# Altium project SPEC_A7.PrjPcb (part 6 of 7)

## Sheet Power.SchDoc: SPEC-A7
size 420 x 297 mm; Author: G.Kasprowicz; CompanyName: WUT ISE; DrawnBy: G.Kasprowicz; Organization: WUT ISE; Address1: PW ISE; Address2: Nowowiejska 15/19 00-665 Warsaw; Address3: gkasprow@gmail.com; Revision: 2; SheetNumber: 2; SheetTotal: 18; ModifiedBy: -; CheckedDate: -; Title2: Power supply; DivGrp: WUT ISE; Designer: G.Kasprowicz; ModifiedDate: -; ProjectName: Sensor Box
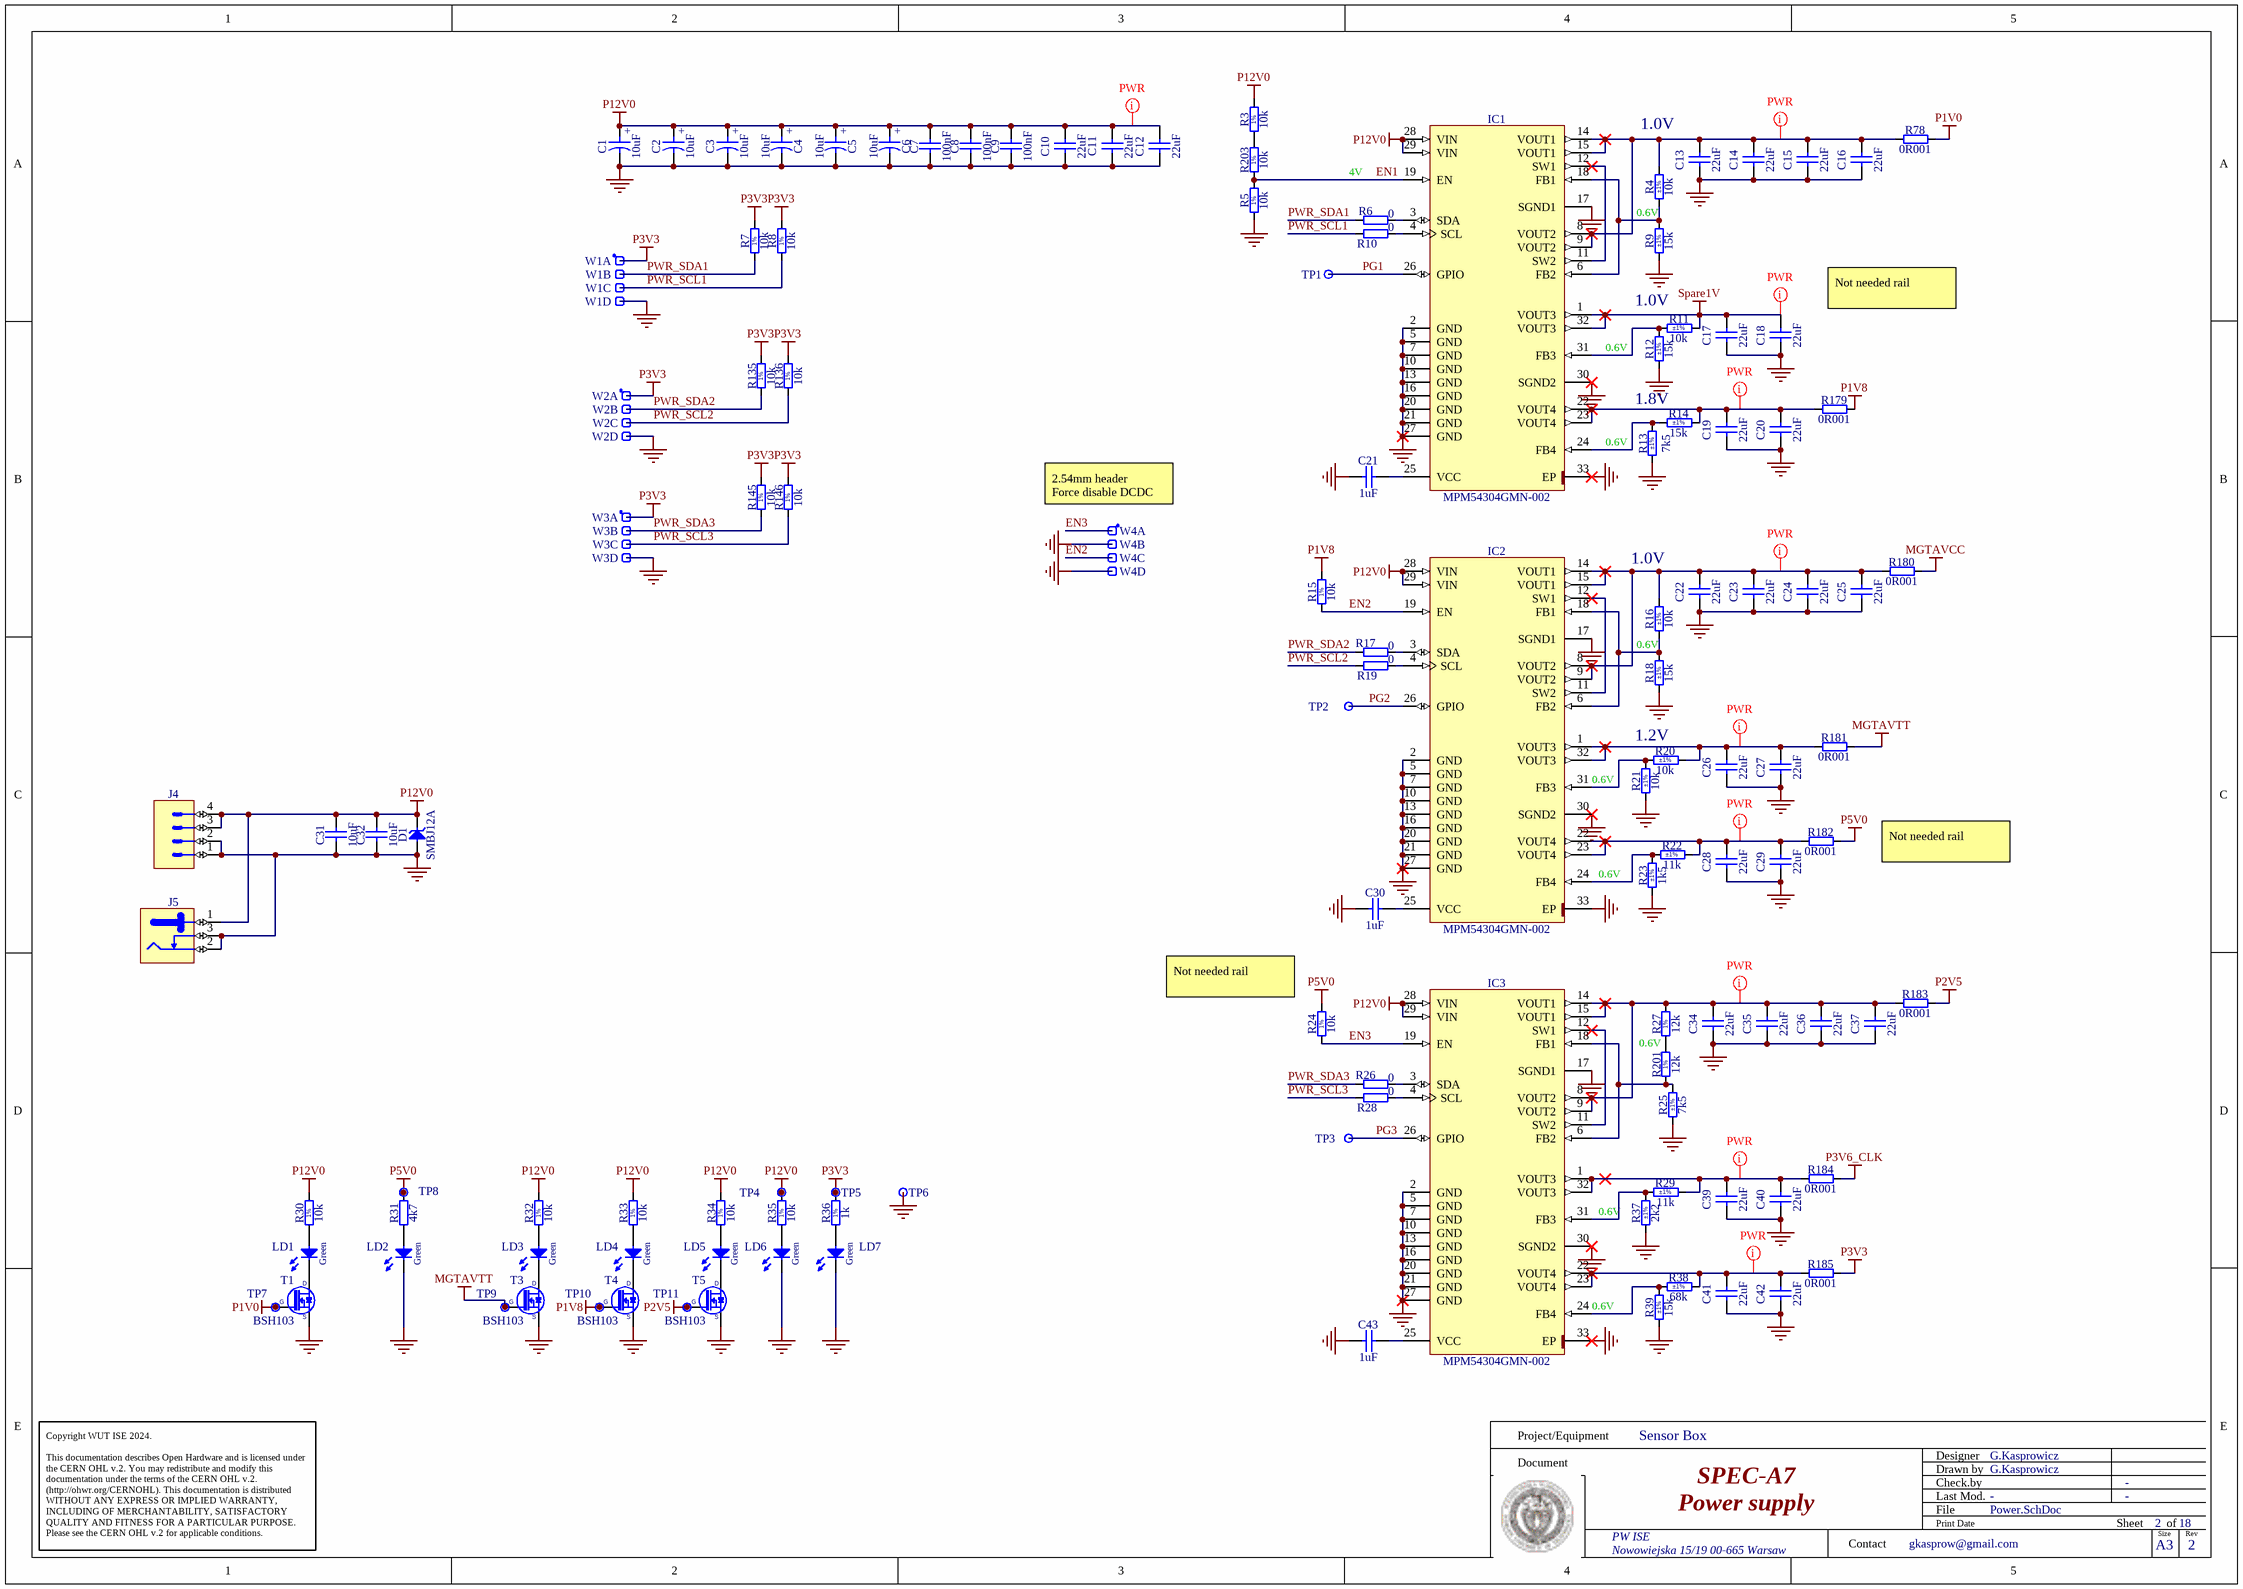
[diagram p14: Power.SchDoc]

### Parts
C1  10uF  [CAPMP3216X180N]
C2  10uF  [CAPMP3216X180N]
C3  10uF  [CAPMP3216X180N]
C4  10uF  [CAPMP3216X180N]
C5  10uF  [CAPMP3216X180N]
C6  10uF  [CAPMP3216X180N]
C7  100nF  [CAPC1005X55N]
C8  100nF  [CAPC1005X55N]
C9  100nF  [CAPC1005X55N]
C10  22uF  [CAPC2012X135N]
C11  22uF  [CAPC2012X135N]
C12  22uF  [CAPC2012X135N]
C13  22uF  [CAPC2012X135N]
C14  22uF  [CAPC2012X135N]
C15  22uF  [CAPC2012X135N]
C16  22uF  [CAPC2012X135N]
C17  22uF  [CAPC2012X135N]
C18  22uF  [CAPC2012X135N]
C19  22uF  [CAPC2012X135N]
C20  22uF  [CAPC2012X135N]
C21  1uF  [CAPC1005X55N]
C22  22uF  [CAPC2012X135N]
C23  22uF  [CAPC2012X135N]
C24  22uF  [CAPC2012X135N]
C25  22uF  [CAPC2012X135N]
C26  22uF  [CAPC2012X135N]
C27  22uF  [CAPC2012X135N]
C28  22uF  [CAPC2012X135N]
C29  22uF  [CAPC2012X135N]
C30  1uF  [CAPC1005X55N]
C31  10uF  [CAPC1608X80N]
C32  10uF  [CAPC1608X80N]
C34  22uF  [CAPC2012X135N]
C35  22uF  [CAPC2012X135N]
C36  22uF  [CAPC2012X135N]
C37  22uF  [CAPC2012X135N]
C39  22uF  [CAPC2012X135N]
C40  22uF  [CAPC2012X135N]
C41  22uF  [CAPC2012X135N]
C42  22uF  [CAPC2012X135N]
C43  1uF  [CAPC1005X55N]
D1  SMBJ12A  [DIOM5336X265N]
IC1  MPM54304GMN-002  [MPS_MPM54304GMN]
IC2  MPM54304GMN-002  [MPS_MPM54304GMN]
IC3  MPM54304GMN-002  [MPS_MPM54304GMN]
J4  Mini-Fit Jr.™  [MOLEX_39-30-0040]  (value not drawn)
J5  Jack  [CUI_PJ-102BH]  (value not drawn)
LD1  Green  [LED_KINGBRIGHT_KPH-1608CGCK]
LD2  Green  [LED_KINGBRIGHT_KPH-1608CGCK]
LD3  Green  [LED_KINGBRIGHT_KPH-1608CGCK]
LD4  Green  [LED_KINGBRIGHT_KPH-1608CGCK]
LD5  Green  [LED_KINGBRIGHT_KPH-1608CGCK]
LD6  Green  [LED_KINGBRIGHT_KPH-1608CGCK]
LD7  Green  [LED_KINGBRIGHT_KPH-1608CGCK]
R3  10k  [RESC1005X40N]
R4  10k  Tolerance: ±1%  [RESC1005X40N]
R5  10k  [RESC1005X40N]
R6  0  [RESC1005X40N]
R7  10k  [RESC1005X40N]
R8  10k  [RESC1005X40N]
R9  15k  Tolerance: ±1%  [RESC1005X40N]
R10  0  [RESC1005X40N]
R11  10k  Tolerance: ±1%  [RESC1005X40N]
R12  15k  Tolerance: ±1%  [RESC1005X40N]
R13  7k5  Tolerance: ±1%  [RESC1005X40N]
R14  15k  Tolerance: ±1%  [RESC1005X40N]
R15  10k  [RESC1005X40N]
R16  10k  Tolerance: ±1%  [RESC1005X40N]
R17  0  [RESC1005X40N]
R18  15k  Tolerance: ±1%  [RESC1005X40N]
R19  0  [RESC1005X40N]
R20  10k  Tolerance: ±1%  [RESC1005X40N]
R21  10k  Tolerance: ±1%  [RESC1005X40N]
R22  11k  Tolerance: ±1%  [RESC1005X40N]
R23  1k5  Tolerance: ±1%  [RESC1005X40N]
R24  10k  [RESC1005X40N]
R25  7k5  Tolerance: ±1%  [RESC1005X40N]
R26  0  [RESC1005X40N]
R27  12k  [RESC1005X40N]
R28  0  [RESC1005X40N]
R29  11k  Tolerance: ±1%  [RESC1005X40N]
R30  10k  [RESC1005X40N]
R31  4k7  [RESC1005X40N]
R32  10k  [RESC1005X40N]
R33  10k  [RESC1005X40N]
R34  10k  [RESC1005X40N]
R35  10k  [RESC1005X40N]
R36  1k  [RESC1005X40N]
R37  2k2  Tolerance: ±1%  [RESC1005X40N]
R38  68k  Tolerance: ±1%  [RESC1005X40N]
R39  15k  Tolerance: ±1%  [RESC1005X40N]
R78  0R001  [RESC2012X60N]
R135  10k  [RESC1005X40N]
R136  10k  [RESC1005X40N]
R145  10k  [RESC1005X40N]
R146  10k  [RESC1005X40N]
R179  0R001  [RESC2012X60N]
R180  0R001  [RESC2012X60N]
R181  0R001  [RESC2012X60N]
R182  0R001  [RESC2012X60N]
R183  0R001  [RESC2012X60N]
R184  0R001  [RESC2012X60N]
R185  0R001  [RESC2012X60N]
R201  12k  [RESC1005X40N]
R203  10k  [RESC1005X40N]
T1  BSH103  [SOT95P230X110-3N]
T3  BSH103  [SOT95P230X110-3N]
T4  BSH103  [SOT95P230X110-3N]
T5  BSH103  [SOT95P230X110-3N]
TP1  Test Point  [TPS127]  (value not drawn)  (no BOM)
TP2  Test Point  [TPS127]  (value not drawn)  (no BOM)
TP3  Test Point  [TPS127]  (value not drawn)  (no BOM)
TP4  Test Point  [TPS127]  (value not drawn)  (no BOM)
TP5  Test Point  [TPS127]  (value not drawn)  (no BOM)
TP6  Test Point  [TPS127]  (value not drawn)  (no BOM)
TP7  Test Point  [TPS127]  (value not drawn)  (no BOM)
TP8  Test Point  [TPS127]  (value not drawn)  (no BOM)
TP9  Test Point  [TPS127]  (value not drawn)  (no BOM)
TP10  Test Point  [TPS127]  (value not drawn)  (no BOM)
TP11  Test Point  [TPS127]  (value not drawn)  (no BOM)
W1  Header 4  [SAMTEC_HTSW-104-23-L-S]  (value not drawn)  (parts A,B,C,D of 4)
W2  Header 4  [SAMTEC_HTSW-104-23-L-S]  (value not drawn)  (parts A,B,C,D of 4)
W3  Header 4  [SAMTEC_HTSW-104-23-L-S]  (value not drawn)  (parts A,B,C,D of 4)
W4  Header 4  [SAMTEC_HTSW-104-23-L-S]  (value not drawn)  (parts A,B,C,D of 4)

### Nets
GND: C1.2 C2.2 C3.2 C4.2 C5.2 C6.2 C7.1 C8.1 C9.1 C10.1 C11.1 C12.1 C13.1 C14.1 C15.1 C16.1 C17.1 C18.1 C19.1 C20.1 C21.1 C22.1 C23.1 C24.1 C25.1 C26.1 C27.1 C28.1 C29.1 C30.1 C31.1 C32.1 C34.1 C35.1 C36.1 C37.1 C39.1 C40.1 C41.1 C42.1 C43.1 D1.2(A) IC1.2(GND) IC1.5(GND) IC1.7(GND) IC1.10(GND) IC1.13(GND) IC1.16(GND) IC1.17(SGND1) IC1.20(GND) IC1.21(GND) IC1.27(GND) IC1.30(SGND2) IC1.33(EP) IC2.2(GND) IC2.5(GND) IC2.7(GND) IC2.10(GND) IC2.13(GND) IC2.16(GND) IC2.17(SGND1) IC2.20(GND) IC2.21(GND) IC2.27(GND) IC2.30(SGND2) IC2.33(EP) IC3.2(GND) IC3.5(GND) IC3.7(GND) IC3.10(GND) IC3.13(GND) IC3.16(GND) IC3.17(SGND1) IC3.20(GND) IC3.21(GND) IC3.27(GND) IC3.30(SGND2) IC3.33(EP) J4.1 J4.2 J5.2 J5.3 LD2.1(C) LD6.1(C) LD7.1(C) R5.1 R9.1 R12.1 R13.1 R18.1 R21.1 R23.1 R25.1 R37.1 R39.1 T1.2(S) T3.2(S) T4.2(S) T5.2(S) TP6.1 W1.4 W2.4 W3.4 W4.2 W4.4
MGTAVCC: R180.2
MGTAVTT: R181.2 T3.1(G) TP9.1
P1V0: R78.2 T1.1(G) TP7.1
P1V8: R15.2 R179.2 T4.1(G) TP10.1
P2V5: R183.2 T5.1(G) TP11.1
P3V3: R7.2 R8.2 R36.2 R135.2 R136.2 R145.2 R146.2 R185.2 TP5.1 W1.1 W2.1 W3.1
P3V6_CLK: R184.2
P5V0: R24.2 R31.2 R182.2 TP8.1
P12V0: C1.1 C2.1 C3.1 C4.1 C5.1 C6.1 C7.2 C8.2 C9.2 C10.2 C11.2 C12.2 C31.2 C32.2 D1.1(C) IC1.28(VIN) IC1.29(VIN) IC2.28(VIN) IC2.29(VIN) IC3.28(VIN) IC3.29(VIN) J4.3 J4.4 J5.1 R3.2 R30.2 R32.2 R33.2 R34.2 R35.2 TP4.1
Spare1V: C17.2 C18.2 IC1.1(VOUT3) IC1.32(VOUT3) R11.2
EN1: IC1.19(EN) R5.2 R203.1
EN2: IC2.19(EN) R15.1 W4.3
EN3: IC3.19(EN) R24.1 W4.1
PG1: IC1.26(GPIO) TP1.1
PG2: IC2.26(GPIO) TP2.1
PG3: IC3.26(GPIO) TP3.1
PWR_SCL1: R8.1 R10.1 W1.3
PWR_SCL2: R19.1 R136.1 W2.3
PWR_SCL3: R28.1 R146.1 W3.3
PWR_SDA1: R6.1 R7.1 W1.2
PWR_SDA2: R17.1 R135.1 W2.2
PWR_SDA3: R26.1 R145.1 W3.2
NetC13_2: C13.2 C14.2 C15.2 C16.2 IC1.8(VOUT2) IC1.9(VOUT2) IC1.14(VOUT1) IC1.15(VOUT1) R4.2 R78.1
NetC19_2: C19.2 C20.2 IC1.22(VOUT4) IC1.23(VOUT4) R14.2 R179.1
NetC21_2: C21.2 IC1.25(VCC)
NetC22_2: C22.2 C23.2 C24.2 C25.2 IC2.8(VOUT2) IC2.9(VOUT2) IC2.14(VOUT1) IC2.15(VOUT1) R16.2 R180.1
NetC26_2: C26.2 C27.2 IC2.1(VOUT3) IC2.32(VOUT3) R20.2 R181.1
NetC28_2: C28.2 C29.2 IC2.22(VOUT4) IC2.23(VOUT4) R22.2 R182.1
NetC30_2: C30.2 IC2.25(VCC)
NetC34_2: C34.2 C35.2 C36.2 C37.2 IC3.8(VOUT2) IC3.9(VOUT2) IC3.14(VOUT1) IC3.15(VOUT1) R27.2 R183.1
NetC39_2: C39.2 C40.2 IC3.1(VOUT3) IC3.32(VOUT3) R29.2 R184.1
NetC41_2: C41.2 C42.2 IC3.22(VOUT4) IC3.23(VOUT4) R38.2 R185.1
NetC43_2: C43.2 IC3.25(VCC)
NetIC1_3: IC1.3(SDA) R6.2
NetIC1_4: IC1.4(SCL) R10.2
NetIC1_6: IC1.6(FB2) IC1.18(FB1) R4.1 R9.2
NetIC1_11: IC1.11(SW2) IC1.12(SW1)
NetIC1_24: IC1.24(FB4) R13.2 R14.1
NetIC1_31: IC1.31(FB3) R11.1 R12.2
NetIC2_3: IC2.3(SDA) R17.2
NetIC2_4: IC2.4(SCL) R19.2
NetIC2_6: IC2.6(FB2) IC2.18(FB1) R16.1 R18.2
NetIC2_11: IC2.11(SW2) IC2.12(SW1)
NetIC2_24: IC2.24(FB4) R22.1 R23.2
NetIC2_31: IC2.31(FB3) R20.1 R21.2
NetIC3_3: IC3.3(SDA) R26.2
NetIC3_4: IC3.4(SCL) R28.2
NetIC3_6: IC3.6(FB2) IC3.18(FB1) R25.2 R201.1
NetIC3_11: IC3.11(SW2) IC3.12(SW1)
NetIC3_24: IC3.24(FB4) R38.1 R39.2
NetIC3_31: IC3.31(FB3) R29.1 R37.2
NetLD1_1: LD1.1(C) T1.3(D)
NetLD1_2: LD1.2(A) R30.1
NetLD2_2: LD2.2(A) R31.1
NetLD3_1: LD3.1(C) T3.3(D)
NetLD3_2: LD3.2(A) R32.1
NetLD4_1: LD4.1(C) T4.3(D)
NetLD4_2: LD4.2(A) R33.1
NetLD5_1: LD5.1(C) T5.3(D)
NetLD5_2: LD5.2(A) R34.1
NetLD6_2: LD6.2(A) R35.1
NetLD7_2: LD7.2(A) R36.1
NetR3_1: R3.1 R203.2
NetR27_1: R27.1 R201.2

### Layout directives
net class PWR: NetC13_2, NetC19_2, NetC22_2, NetC26_2, NetC28_2, NetC34_2, NetC39_2, NetC41_2, P12V0, Spare1V

### Notes on the sheet
- 4V
- 1.0V
- 0.6V
- (near C18) Not needed rail
- 1.8V
- (near W4) 2.54mm header
  Force disable DCDC
- 1.2V
- (near R182) Not needed rail
- (near R24) Not needed rail
- (near IC3) 0.6V
- Project/Equipment
- Document
- Designer
- Drawn by
- Check.by
- Copyright WUT ISE 2024.
  This documentation describes Open Hardware and is licensed under the CERN OHL v.2. You may redistribute and modify this documentation under the terms of the CERN OHL v.2. (http://ohwr.org/CERNOHL). This documentation is distributed WITHOUT ANY EXPRESS OR IMPLIED WARRANTY, INCLUDING OF MERCHANTABILITY, SATISFACTORY QUALITY AND FITNESS FOR A PARTICULAR PURPOSE. Please see the CERN OHL v.2 for applicable conditions.
- Contact
- File
- Last Mod.
- Print Date
- Sheet
- Size
- A3
- of
- Rev
- (in symbol CTE3216-18_10UF_16V_20%_AVX_TCJ) +
- (in symbol R0402_1k_1%_0.0625W_100PPM) 1%
- (in symbol R0402_10K_1%_0.0625W_100PPM) 1%
- (in symbol R0402_12K_1%_0.0625W_100PPM) 1%

### Library data of the parts
C1-C6 = CTE3216-18_10UF_16V_20%_AVX_TCJ: Polarised capacitor; Part Description: ESR 0R200 Tantalum Solid Electrolytic Chip Capacitor with Conductive Polymer Electrode; Manufacturer: AVX; Manufacturer Part Number: TCJA106M016R0200; Voltage: 16V; Tolerance: ±20%; Part Number: CTE3216-18_10UF_16V_20%_AVX_TCJ; Component Kind: Standard; Component Type: Standard; Pin Count: 2; Value: 10uF; Status: Preferred; Case: A; Mounted: Yes; Socket: No; SMD: Yes; Sense: No; HelpURL: \\cern.ch\dfs\Applications\Altium\Datasheets\CTE_AVX_TCJ.pdf; Author: CERN DEM JLC; CreateDate: 29.03.2012; LatestRevisionDate: 29.03.2012; ComponentHeight: 1.8mm
C7-C9 = CC0402_100NF_16V_10%_X7R: Non-polarised capacitor; Part Description: SMD Multilayer Chip Ceramic Capacitor; Manufacturer: GENERIC; Manufacturer1 Part Number: GRM155R71C104KA88D; Voltage: 16V; TC: X7R; Tolerance: ±10%; Part Number: CC0402_100NF_16V_10%_X7R; Component Kind: Standard; Component Type: Standard; Pin Count: 2; Value: 100nF; Status: Not Recommended; Manufacturer Part Number: CC0402_100NF_16V_10%_X7R; Case: 0402; Mounted: Yes; Socket: No; SMD: Yes; Sense: No; Manufacturer1 Example: MURATA; Manufacturer1 ComponentHeight: 0.55mm; HelpURL: \\cern.ch\dfs\Applications\Altium\Datasheets\CC0402_X7R_MURATA_GRM.pdf; Author: CERN DEM JLC; CreateDate: 05/12/2013; LatestRevisionDate: 03/12/2007
C10-C20 C22-C29 C34-C37 C39-C42 = CC0805_22UF_16V_10%_X5R: Non-polarised capacitor; Manufacturer: GENERIC; Part Description: SMD Multilayer Chip Ceramic Capacitor; Manufacturer1 Part Number: C2012X5R1C226KT; Tolerance: ±10%; Voltage: 16V; TC: X5R; Manufacturer Part Number: CC0805_22UF_16V_10%_X5R; Part Number: CC0805_22UF_16V_10%_X5R; Value: 22uF; Component Kind: Standard; Component Type: Standard; Pin Count: 2; Status: Preferred; Case: 0805; Mounted: Yes; Socket: No; SMD: Yes; Sense: No; Manufacturer1 Example: TDK; Manufacturer1 ComponentHeight: 1.35mm; HelpURL: \\cern.ch\dfs\Applications\Altium\Datasheets\CC0805_X5R_TDK_C.pdf; Author: CERN DEM JLC; CreateDate: 25.10.2012; LatestRevisionDate: 25.10.2012
C21 C30 C43 = CC0402_1UF_16V_10%_X5R: Non-polarised capacitor; Part Description: SMD Multilayer Chip Ceramic Capacitor; Manufacturer: GENERIC; Manufacturer1 Part Number: C1005X5R1C105KT; Voltage: 16V; TC: X5R; Tolerance: ±10%; Part Number: CC0402_1UF_16V_10%_X5R; Component Kind: Standard; Component Type: Standard; Pin Count: 2; Value: 1uF; Status: Preferred; Manufacturer Part Number: CC0402_1UF_16V_10%_X5R; Case: 0402; Mounted: Yes; Socket: No; SMD: Yes; Sense: No; Manufacturer1 Example: TDK; Manufacturer1 ComponentHeight: 0.55mm; HelpURL: \\cern.ch\dfs\Applications\Altium\Datasheets\CC0402_X5R_TDK_C.pdf; Author: CERN DEM JLC; CreateDate: 25.10.2012; LatestRevisionDate: 25.10.2012
C31 C32 = CC0603_10UF_16V_20%_X5R: Non-polarised capacitor; Part Description: SMD Multilayer Chip Ceramic Capacitor; Manufacturer: GENERIC; Manufacturer1 Part Number: GRM188R61C106MA73D; Voltage: 16V; TC: X5R; Tolerance: ±20%; Part Number: CC0603_10UF_16V_20%_X5R; Component Kind: Standard; Component Type: Standard; Pin Count: 2; Value: 10uF; Status: None; Manufacturer Part Number: CC0603_10UF_16V_20%_X5R; Case: 0603; Mounted: Yes; Socket: No; SMD: Yes; Sense: No; Manufacturer1 Example: MURATA; Manufacturer1 ComponentHeight: 0.8mm; HelpURL: \\cern.ch\dfs\Applications\Altium\Datasheets\CC0603_X5R_MURATA_GRM.pdf; Author: CERN DEM MR; CreateDate: 02.03.2016; LatestRevisionDate: 02.03.2016
D1 = SMBJ12A: Zener Diode; Part Description: Uni-Directional Transient Voltage Suppressor Diode; Manufacturer: FAIRCHILD SEMICONDUCTOR; Voltage: 12V; Power: 600W; PressFit: No; Bonding: No; Part Number: SMBJ12A; Component Kind: Standard; Component Type: Standard; Device: SMBJ12A; PackageDescription: DO-214-AA/SMB Diode, Molded Body; 5.34mm L X 3.625mm W X 2.65mm H, IPC Medium Density; Manufacturer Part Number: SMBJ12A; Pin Count: 2; Case: DO-214AA; Mounted: Yes; Socket: No; SMD: Yes; Sense: No; ComponentHeight: 2.65mm; HelpURL: \\cern.ch\dfs\Applications\Altium\Datasheets\SMBJ.pdf; Author: CERN DEM JLC; CreateDate: 10.04.2013; LatestRevisionDate: 10.04.2013
IC1-IC3 = MPM54304GMN-XXXX: Quad-Output Power Module with I2C and MTP; Part Description: 4V to 16V Input, Quad-Output Power Module with I2C and MTP; Manufacturer: MPS (MONOLITIC  POWER SYSTEMS); PressFit: No; Bonding: No; Part Number: MPM54304GMN-002; Component Kind: Standard; Component Type: Standard; Device: MPM54304GMN-002; PackageDescription: MPS LGA-33 Case, 0.65mm Pitch, Rect.; 32 Pin, 7.00mm L X 7.00mm W X 2.10mm H body (w/Thermal Tab 3.55 X 3.55mm); Manufacturer Part Number: MPM54304GMN-002; Pin Count: 33; Case: QFN32; Mounted: Yes; Socket: No; SMD: Yes; Sense: No; ComponentHeight: 2.1mm; HelpURL: \\cern.ch\dfs\Applications\Altium\Datasheets\MPM54304GMN.pdf; Author: CERN DEM BC; CreateDate: 09.11.2020; LatestRevisionDate: 23.11.2022
J4 = MOLEX_39-30-0040: Connector 4 Male; Part Description: 4.20mm (.165") Pitch Mini-Fit Jr. Header, Dual Row, Right Angle with Snap-in Plastic Peg PCB Lock, 4 Circuits; Manufacturer: MOLEX; PressFit: No; Part Number: MOLEX_39-30-0040; Component Kind: Standard; Component Type: Standard; Pin Count: 4; Family: Mini-Fit Jr.™; Mounted: Yes; Socket: No; SMD: No; Sense: No; Status: None; Manufacturer Part Number: 39-30-0040; ComponentHeight: 11.4mm; HelpURL: \\cern.ch\dfs\Applications\Altium\Datasheets\MOLEX_39-30-0040.pdf; Author: CERN DEM JLC; CreateDate: 2018-10-02; LatestRevisionDate: 2018-10-02
J5 = CUI_PJ-102BH: 2.5 mm Center Pin, 5A, 24V Right Angle, Through Hole, Tapered Pins, DC Power Jack Connector; Part Description: 2.5 mm Center Pin, 5A, 24V, Right Angle, Through Hole, Tapered Pins, DC Power Jack Connector; Manufacturer: CUI INC.; PressFit: No; Part Number: CUI_PJ-102BH; Component Kind: Standard; Component Type: Standard; Pin Count: 3; Family: Jack; Mounted: Yes; Socket: No; SMD: No; Sense: No; Status: None; Manufacturer Part Number: PJ-102BH; ComponentHeight: 11mm; HelpURL: \\cern.ch\dfs\Applications\Altium\Datasheets\CUI_PJ-102BH.pdf; Author: CERN DEM JLC; CreateDate: 14.08.2013; LatestRevisionDate: 14.08.2013
LD1-LD7 = LED_KINGBRIGHT_KPH-1608CGCK: LED Green 1C 2A; Part Description: SMD Green LED, Case 1.6mmX0.8mm(0603), 0.65mm Thickness; PressFit: No; Bonding: No; Manufacturer Part Number: KPH-1608CGCK; ComponentHeight: 0.65mm; HelpURL: \\cern.ch\dfs\Applications\Altium\Datasheets\LED_KINGBRIGHT_KPH-1608CGCK.pdf; Part Number: LED_KINGBRIGHT_KPH-1608CGCK; Component Kind: Standard; Component Type: Standard; Color: Green; PackageDescription: SMT Green LED, Case 0603, Body L 1.6 x W 0.8mm H 0.65mm; Manufacturer: KINGBRIGHT; Pin Count: 2; Mounted: Yes; Socket: No; SMD: Yes; Sense: No; Author: CERN DEM JLC; CreateDate: 03.07.2017; LatestRevisionDate: 03.07.2017
R3-R5 R7 R8 R11 R15 R16 R20 R21 R24 R30 R32-R35 R135 R136 R145 R146 R203 = R0402_10K_1%_0.0625W_100PPM: Resistor - 1%; Part Description: General Purpose Thick Film Chip Resistor; Manufacturer: GENERIC; Manufacturer1 Part Number: 232270671003L; TC: ±100ppm/°C; PressFit: No; Part Number: R0402_10K_1%_0.0625W_100PPM; Component Kind: Standard; Component Type: Standard; Pin Count: 2; Value: 10k; Status: Not Recommended; Power: 0.0625W; Manufacturer Part Number: R0402_10K_1%_0.0625W_100PPM; Case: 0402; Mounted: Yes; Sense: No; Socket: No; SMD: Yes; Manufacturer1 Example: YAGEO PHYCOMP; Manufacturer1 ComponentHeight: 0.4mm; HelpURL: \\cern.ch\dfs\Applications\Altium\Datasheets\R0402_Phycomp_RC0402.pdf; Author: CERN DEM JLC; CreateDate: 03.12.2007; LatestRevisionDate: 17.10.2012
  R3 R5 R7 R8 R15 R24 R30 R32-R35 R135 R136 R145 R146 R203: Tolerance: ±1%
R6 R10 R17 R19 R26 R28 = R0402_0R_JUMPER: Resistor; Part Description: 1A (0.05R Max DC Resistance) Zero Ohm Jumper; Manufacturer: GENERIC; Manufacturer1 Part Number: 232270591001L; PressFit: No; Part Number: R0402_0R_JUMPER; Component Kind: Standard; Component Type: Standard; Pin Count: 2; Value: 0; Status: Not Recommended; Manufacturer Part Number: R0402_0R_JUMPER; Case: 0402; Mounted: Yes; Sense: No; Socket: No; SMD: Yes; Manufacturer1 Example: YAGEO PHYCOMP; Manufacturer1 ComponentHeight: 0.4mm; HelpURL: \\cern.ch\dfs\Applications\Altium\Datasheets\R0402_Phycomp_RC0402.pdf; Author: CERN DEM JLC; CreateDate: 03.12.2007; LatestRevisionDate: 17.10.2012
R9 R12 R14 R18 R39 = R0402_15K_1%_0.0625W_100PPM: Resistor - 1%; Part Description: General Purpose Thick Film Chip Resistor; Manufacturer: GENERIC; Manufacturer1 Part Number: CRCW040215K0FK; TC: ±100ppm/°C; PressFit: No; Part Number: R0402_15K_1%_0.0625W_100PPM; Component Kind: Standard; Component Type: Standard; Pin Count: 2; Value: 15k; Status: Preferred; Power: 0.0625W; Manufacturer Part Number: R0402_15K_1%_0.0625W_100PPM; Case: 0402; Mounted: Yes; Sense: No; Socket: No; SMD: Yes; Manufacturer1 Example: VISHAY; Manufacturer1 ComponentHeight: 0.4mm; HelpURL: \\cern.ch\dfs\Applications\Altium\Datasheets\R0402_VISHAY_CRCW e3.pdf; Author: CERN DEM JMW; CreateDate: 06.07.2015; LatestRevisionDate: 06.07.2015
R13 R25 = R0402_7K5_1%_0.0625W_100PPM: Resistor - 1%; Part Description: General Purpose Thick Film Chip Resistor; Manufacturer: GENERIC; Manufacturer1 Part Number: 232270677502L; TC: ±100ppm/°C; PressFit: No; Part Number: R0402_7K5_1%_0.0625W_100PPM; Component Kind: Standard; Component Type: Standard; Pin Count: 2; Value: 7k5; Status: Not Recommended; Power: 0.0625W; Manufacturer Part Number: R0402_7K5_1%_0.0625W_100PPM; Case: 0402; Mounted: Yes; Sense: No; Socket: No; SMD: Yes; Manufacturer1 Example: YAGEO PHYCOMP; Manufacturer1 ComponentHeight: 0.4mm; HelpURL: \\cern.ch\dfs\Applications\Altium\Datasheets\R0402_Phycomp_RC0402.pdf; Author: CERN DEM JLC; CreateDate: 03.12.2007; LatestRevisionDate: 17.10.2012
R22 R29 = R0402_11K_1%_0.0625W_100PPM: Resistor - 1%; Part Description: General Purpose Thick Film Chip Resistor; Manufacturer: GENERIC; Manufacturer1 Part Number: 232270671103L; TC: ±100ppm/°C; PressFit: No; Part Number: R0402_11K_1%_0.0625W_100PPM; Component Kind: Standard; Component Type: Standard; Pin Count: 2; Value: 11k; Status: Not Recommended; Power: 0.0625W; Manufacturer Part Number: R0402_11K_1%_0.0625W_100PPM; Case: 0402; Mounted: Yes; Sense: No; Socket: No; SMD: Yes; Manufacturer1 Example: YAGEO PHYCOMP; Manufacturer1 ComponentHeight: 0.4mm; HelpURL: \\cern.ch\dfs\Applications\Altium\Datasheets\R0402_Phycomp_RC0402.pdf; Author: CERN DEM JLC; CreateDate: 03.12.2007; LatestRevisionDate: 17.10.2012
R23 = R0402_1K5_1%_0.0625W_100PPM: Resistor - 1%; Part Description: General Purpose Thick Film Chip Resistor; Manufacturer: GENERIC; Manufacturer1 Part Number: 232270671502L; TC: ±100ppm/°C; PressFit: No; Part Number: R0402_1K5_1%_0.0625W_100PPM; Component Kind: Standard; Component Type: Standard; Pin Count: 2; Value: 1k5; Status: Not Recommended; Power: 0.0625W; Manufacturer Part Number: R0402_1K5_1%_0.0625W_100PPM; Case: 0402; Mounted: Yes; Sense: No; Socket: No; SMD: Yes; Manufacturer1 Example: YAGEO PHYCOMP; Manufacturer1 ComponentHeight: 0.4mm; HelpURL: \\cern.ch\dfs\Applications\Altium\Datasheets\R0402_Phycomp_RC0402.pdf; Author: CERN DEM JLC; CreateDate: 03.12.2007; LatestRevisionDate: 17.10.2012
R27 R201 = R0402_12K_1%_0.0625W_100PPM: Resistor - 1%; Part Description: General Purpose Thick Film Chip Resistor; Manufacturer: GENERIC; Manufacturer1 Part Number: 232270671203L; TC: ±100ppm/°C; PressFit: No; Part Number: R0402_12K_1%_0.0625W_100PPM; Component Kind: Standard; Component Type: Standard; Pin Count: 2; Value: 12k; Status: Not Recommended; Power: 0.0625W; Tolerance: ±1%; Manufacturer Part Number: R0402_12K_1%_0.0625W_100PPM; Case: 0402; Mounted: Yes; Sense: No; Socket: No; SMD: Yes; Manufacturer1 Example: YAGEO PHYCOMP; Manufacturer1 ComponentHeight: 0.4mm; HelpURL: \\cern.ch\dfs\Applications\Altium\Datasheets\R0402_Phycomp_RC0402.pdf; Author: CERN DEM JLC; CreateDate: 03.12.2007; LatestRevisionDate: 17.10.2012
R31 = R0402_4K7_1%_0.0625W_100PPM: as R45-R47 on sheet FPGA_PWR_CONFIG; Part Number: R0402_4K7_1%_0.0625W_100PPM; Component Kind: Standard; Component Type: Standard; Pin Count: 2; Value: 4k7; Status: Not Recommended; Power: 0.0625W; Tolerance: ±1%; Manufacturer Part Number: R0402_4K7_1%_0.0625W_100PPM; Case: 0402; Mounted: Yes; Sense: No; Socket: No; SMD: Yes; Manufacturer1 Example: YAGEO PHYCOMP; Manufacturer1 ComponentHeight: 0.4mm; HelpURL: \\cern.ch\dfs\Applications\Altium\Datasheets\R0402_Phycomp_RC0402.pdf; Author: CERN DEM JLC; CreateDate: 03.12.2007; LatestRevisionDate: 17.10.2012
R36 = R0402_1k_1%_0.0625W_100PPM: Resistor - 1%; Part Description: General Purpose Thick Film Chip Resistor; Manufacturer: GENERIC; Manufacturer1 Part Number: 232270671002L; TC: ±100ppm/°C; PressFit: No; Part Number: R0402_1K_1%_0.0625W_100PPM; Component Kind: Standard; Component Type: Standard; Pin Count: 2; Value: 1k; Status: Not Recommended; Power: 0.0625W; Tolerance: ±1%; Manufacturer Part Number: R0402_1K_1%_0.0625W_100PPM; Case: 0402; Mounted: Yes; Sense: No; Socket: No; SMD: Yes; Manufacturer1 Example: YAGEO PHYCOMP; Manufacturer1 ComponentHeight: 0.4mm; HelpURL: \\cern.ch\dfs\Applications\Altium\Datasheets\R0402_Phycomp_RC0402.pdf; Author: CERN DEM JLC; CreateDate: 03.12.2007; LatestRevisionDate: 17.10.2012
R37 = R0402_2K2_1%_0.0625W_100PPM: Resistor - 1%; Part Description: General Purpose Thick Film Chip Resistor; Manufacturer: GENERIC; Manufacturer1 Part Number: 232270672202L; TC: ±100ppm/°C; PressFit: No; Part Number: R0402_2K2_1%_0.0625W_100PPM; Component Kind: Standard; Component Type: Standard; Pin Count: 2; Value: 2k2; Status: Not Recommended; Power: 0.0625W; Manufacturer Part Number: R0402_2K2_1%_0.0625W_100PPM; Case: 0402; Mounted: Yes; Sense: No; Socket: No; SMD: Yes; Manufacturer1 Example: YAGEO PHYCOMP; Manufacturer1 ComponentHeight: 0.4mm; HelpURL: \\cern.ch\dfs\Applications\Altium\Datasheets\R0402_Phycomp_RC0402.pdf; Author: CERN DEM JLC; CreateDate: 03.12.2007; LatestRevisionDate: 17.10.2012
R38 = R0402_68K_1%_0.0625W_100PPM: Resistor - 1%; Part Description: General Purpose Thick Film Chip Resistor; Manufacturer: GENERIC; Manufacturer1 Part Number: 232270676803L; TC: ±100ppm/°C; PressFit: No; Part Number: R0402_68K_1%_0.0625W_100PPM; Component Kind: Standard; Component Type: Standard; Pin Count: 2; Value: 68k; Status: Not Recommended; Power: 0.0625W; Manufacturer Part Number: R0402_68K_1%_0.0625W_100PPM; Case: 0402; Mounted: Yes; Sense: No; Socket: No; SMD: Yes; Manufacturer1 Example: YAGEO PHYCOMP; Manufacturer1 ComponentHeight: 0.4mm; HelpURL: \\cern.ch\dfs\Applications\Altium\Datasheets\R0402_Phycomp_RC0402.pdf; Author: CERN DEM JLC; CreateDate: 03.12.2007; LatestRevisionDate: 17.10.2012
R78 R179-R185 = R0805_0R001_1%_0.5W_100PPM: SMD current sensing resistor- metal strip; Part Number: MSMA0805R0010FSM; Manufacturer: GENERIC; PressFit: No; Component Kind: Standard; Component Type: Standard; Pin Count: 2; Value: 0R001; Status: Preferred; Part Description: R0805_0R001_1%_0.5W_100PPM; Manufacturer Part Number: R0805_0R001_1%_0.5W_100PPM; Case: 0805; Mounted: Yes; Sense: No; Socket: No; SMD: Yes; Manufacturer1 Example: Eaton; Manufacturer1 Part Number: MSMA0805R0010FSM; Manufacturer1 ComponentHeight: 0.6mm; HelpURL: \\cern.ch\dfs\Applications\Altium\Datasheets\R0805_NIC_NRC.pdf; Author: GK; CreateDate: 03.12.2007; LatestRevisionDate: 13.03.2008
T1 T3-T5 = BSH103: N-CHANNEL MOSFET WITH DIODE; Part Description: 30V 850mA N-Channel Enhancement Mode Field-Effect Transistor; Manufacturer: NEXPERIA; PressFit: No; Bonding: No; Part Number: BSH103; Component Kind: Standard; Component Type: Standard; Device: BSH103; PackageDescription: SOT23, 3 pin, Pitch 0.95mm - 1.3mm W X 2.9mm L X 1.1mm H, IPC Medium Density; Manufacturer Part Number: BSH103; Pin Count: 3; Case: SOT23-3; Mounted: Yes; Socket: No; SMD: Yes; Sense: No; ComponentHeight: 1.1mm; HelpURL: \\cern.ch\dfs\Applications\Altium\Datasheets\BSH103.pdf; Author: CERN DEM JLC; CreateDate: 16.03.2010; LatestRevisionDate: 20.06.2017
TP1-TP11 = SMD_PAD_1.27X1.27MM: Part Description: 1.27mm x 1.27mm PCB Copper Area (SMD Test Point); Mounted: No; Part Number: SMD_PAD_1.27X1.27MM; Component Type: Standard (No BOM); Pin Count: 1; Family: Test Point; Socket: No; SMD: Yes; Sense: No; Status: None; ComponentHeight: 0mm; HelpURL: Undefined; Author: CERN DEM JLC; CreateDate: 12.01.2008; LatestRevisionDate: 12.01.2008; PackageDescription: 1.27mm x 1.27mm PCB Copper Area (SMD Test Point)
W1-W4 = SAMTEC_HTSW-104-23-L-S: 4 Mini Wire-Wrap Contact Strip Header; Part Description: 4 Contacts, Pitch 2.54mm, Single Row  Through Mount Straight Header (Post Lead 5.84mm, Tail Lead 2.92mm, Insulator 2.54mm); Manufacturer: SAMTEC; PressFit: No; Status Comment: High Temperature; Part Number: SAMTEC_HTSW-104-23-L-S; Component Kind: Standard; Component Type: Standard; Pin Count: 4; Family: Header 4; Mounted: Yes; Socket: No; Sense: No; SMD: No; Status: Preferred; Manufacturer Part Number: HTSW-104-23-L-S; ComponentHeight: 8.38mm; HelpURL: \\cern.ch\dfs\Applications\Altium\Datasheets\SAMTEC_HTSW-104-23-L-S.pdf; Author: CERN DEM JLC; CreateDate: 22/02/2018; LatestRevisionDate: 22/02/2018

## Sheet Misc.SchDoc: SPEC-A7
size 420 x 297 mm; Author: G.Kasprowicz; CompanyName: WUT ISE; DrawnBy: G.Kasprowicz; Organization: WUT ISE; Address1: PW ISE; Address2: Nowowiejska 15/19 00-665 Warsaw; Address3: gkasprow@gmail.com; Revision: 2; SheetNumber: 16; SheetTotal: 18; ModifiedBy: -; CheckedDate: -; Title2: Misc; DivGrp: WUT ISE; Designer: G.Kasprowicz; ModifiedDate: -; ProjectName: Sensor Box
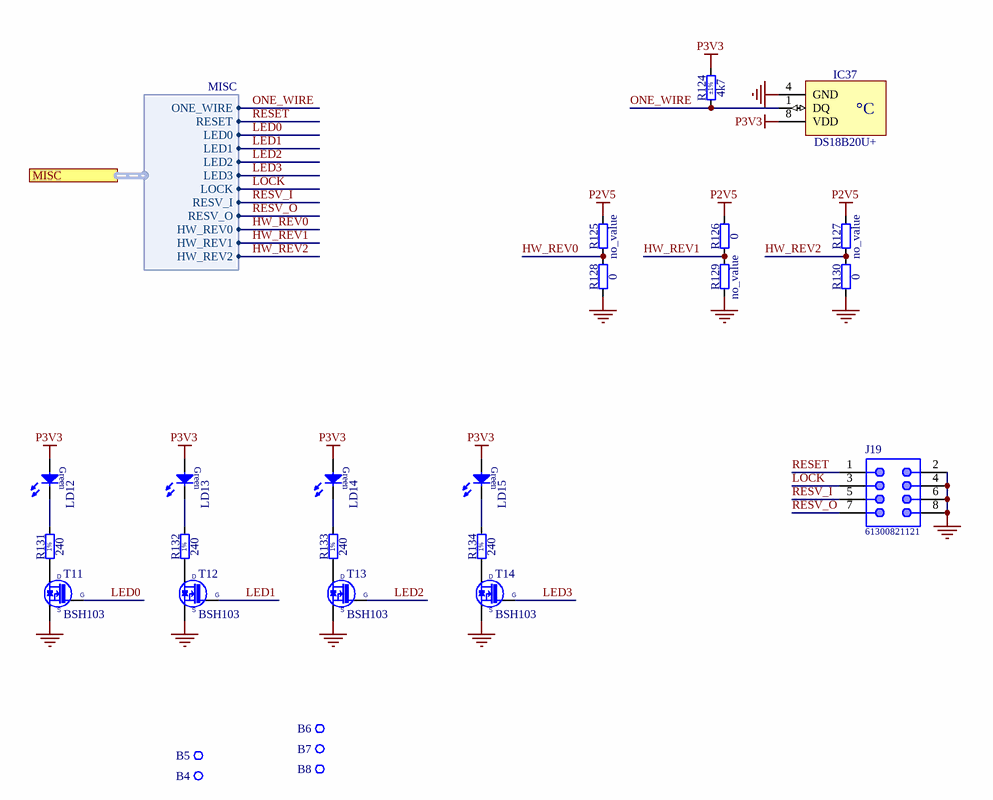
[diagram p15: Misc.SchDoc]

### Parts
B4  Plated Hole  [MTG270_500]  (value not drawn)  (no BOM)
B5  Plated Hole  [MTG270_500]  (value not drawn)  (no BOM)
B6  Non Plated Hole  [MTG400]  (value not drawn)  (no BOM)
B7  Non Plated Hole  [MTG400]  (value not drawn)  (no BOM)
B8  Non Plated Hole  [MTG400]  (value not drawn)  (no BOM)
IC37  DS18B20U+  [SOP65P490X110-8N]
J19  61300821121  [61300821121]
LD12  Green  [LED_AVAGO_HSME-C120]  (value not drawn)
LD13  Green  [LED_AVAGO_HSME-C120]  (value not drawn)
LD14  Green  [LED_AVAGO_HSME-C120]  (value not drawn)
LD15  Green  [LED_AVAGO_HSME-C120]  (value not drawn)
R124  4k7  Tolerance: ±1%  [RESC1005X40N]
R125  no_value  [RESC1005X40N]  (no BOM)
R126  0  [RESC1005X40N]
R127  no_value  [RESC1005X40N]  (no BOM)
R128  0  [RESC1005X40N]
R129  no_value  [RESC1005X40N]  (no BOM)
R130  0  [RESC1005X40N]
R131  240  [RESC1005X40N]
R132  240  [RESC1005X40N]
R133  240  [RESC1005X40N]
R134  240  [RESC1005X40N]
T11  BSH103  [SOT95P230X110-3N]
T12  BSH103  [SOT95P230X110-3N]
T13  BSH103  [SOT95P230X110-3N]
T14  BSH103  [SOT95P230X110-3N]

### Ports
MISC (harness MISC, see SPEC-A7-TOP[3C], FPGA_14_15[1D])

### Harnesses
MISC: ONE_WIRE, RESET, LED0, LED1, LED2, LED3, LOCK, RESV_I, RESV_O, HW_REV0, HW_REV1, HW_REV2

### Nets
GND: IC37.4(GND) J19.2 J19.4 J19.6 J19.8 R128.1 R129.1 R130.1 T11.2(S) T12.2(S) T13.2(S) T14.2(S)
P2V5: R125.2 R126.2 R127.2
P3V3: IC37.8(VDD) LD12.2(A) LD13.2(A) LD14.2(A) LD15.2(A) R124.2
HW_REV0: R125.1 R128.2 ; port MISC.HW_REV0
HW_REV1: R126.1 R129.2 ; port MISC.HW_REV1
HW_REV2: R127.1 R130.2 ; port MISC.HW_REV2
LED0: T11.1(G) ; port MISC.LED0
LED1: T12.1(G) ; port MISC.LED1
LED2: T13.1(G) ; port MISC.LED2
LED3: T14.1(G) ; port MISC.LED3
LOCK: J19.3 ; port MISC.LOCK
ONE_WIRE: IC37.1(DQ) R124.1 ; port MISC.ONE_WIRE
RESET: J19.1 ; port MISC.RESET
RESV_I: J19.5 ; port MISC.RESV_I
RESV_O: J19.7 ; port MISC.RESV_O
NetLD12_1: LD12.1(C) R131.2
NetLD13_1: LD13.1(C) R132.2
NetLD14_1: LD14.1(C) R133.2
NetLD15_1: LD15.1(C) R134.2
NetR131_1: R131.1 T11.3(D)
NetR132_1: R132.1 T12.3(D)
NetR133_1: R133.1 T13.3(D)
NetR134_1: R134.1 T14.3(D)

Not connected (* = marked no-connect by the designer): B4 1; B5 1; B6 1; B7 1; B8 1

### Notes on the sheet
- Project/Equipment
- Document
- Designer
- Drawn by
- Check.by
- Copyright WUT ISE 2024.
  This documentation describes Open Hardware and is licensed under the CERN OHL v.2. You may redistribute and modify this documentation under the terms of the CERN OHL v.2. (http://ohwr.org/CERNOHL). This documentation is distributed WITHOUT ANY EXPRESS OR IMPLIED WARRANTY, INCLUDING OF MERCHANTABILITY, SATISFACTORY QUALITY AND FITNESS FOR A PARTICULAR PURPOSE. Please see the CERN OHL v.2 for applicable conditions.
- Contact
- File
- Last Mod.
- Print Date
- Sheet
- Size
- A3
- of
- Rev
- (in symbol DS18B20U+) °C
- (in symbol R0402_240R_1%_0.0625W_100PPM) 1%

### Library data of the parts
B4 B5 = PLATED_HOLE2.7_PAD5.0: Single Terminal Socket; Part Description: Plated Through Hole: Hole Dia.=2.7mm Pad Dia.=5.0mm; Mounted: No; Part Number: PLATED_HOLE2.7_PAD5.0; Component Type: Standard (No BOM); Pin Count: 1; Family: Plated Hole; Socket: No; SMD: No; Sense: No; Status: None; ComponentHeight: 0mm; HelpURL: Undefined; Author: CERN DEM JMW; CreateDate: 27.09.2011; LatestRevisionDate: 27.09.2011; PackageDescription: Plated Through Hole: Hole Dia.=2.7mm Pad Dia.=5.0mm
B6-B8 = NON-PLATED_HOLE4.0: Single Terminal Socket; Part Description: Non Plated Through Hole: Hole Dia.=4.0mm; Mounted: No; Part Number: NON-PLATED_HOLE4.0; Component Type: Standard (No BOM); Pin Count: 1; Family: Non Plated Hole; Socket: No; SMD: No; Sense: No; Status: None; ComponentHeight: 0mm; HelpURL: Undefined; Author: CERN DEM JMW; CreateDate: 22.03.2019; LatestRevisionDate: 22.03.2019; PackageDescription: Non Plated Through Hole: Hole Dia.=4.0mm
IC37 = DS18B20U+: Programmable Resolution 1-Wire Digital Thermometer; Part Description: Programmable Resolution 1-Wire Digital Thermometer (-55°C to +125°C); Manufacturer: DALLAS MAXIM; PressFit: No; Bonding: No; Part Number: DS18B20U+; Component Kind: Standard; Component Type: Standard; Device: DS18B20U+; PackageDescription: SOP, 0.65mm Pitch; 8 Pin, 3.00mm W X 3.00mm L X 1.10mm H body, IPC Medium Density; Manufacturer Part Number: DS18B20U; Pin Count: 3; Case: uSOP8; Mounted: Yes; Socket: No; SMD: Yes; Sense: No; ComponentHeight: 1.1mm; HelpURL: \\cern.ch\dfs\Applications\Altium\Datasheets\DS18B20U+.pdf; Author: CERN DEM JLC; CreateDate: 17.03.2010; LatestRevisionDate: 22.06.2023
J19 = 61300821121: WR-PHD Pin Header, THT, pitch 2.54mm, Dual Row, Vertical, 8pin; Pin Number: 8; Gender: Male; Rated Current: 3A; Working Voltage: 250VAC; Withstanding Voltage: 500VAC; Contact Resistance: 20mOhm; ComponentLink1Description: Manufacturer; ComponentLink1URL: http://www.we-online.de; ComponentLink2Description: Datasheet; ComponentLink2URL: https://katalog.we-online.de/em/datasheet/6130xx21121.pdf; Part Number: 61300821121; Published Date: June 2019; Publisher: Wurth Elektronik; Pitch: 2.54mm; Operating Temperature: -40 to +105degC; Mounting Technology: THT; Packaging: Bag; Row Number: Dual; Orientation: Vertical
LD12-LD15 = LED_AVAGO_HSME-C120: LED Green 1C 2A; Part Description: High Performance Right Angle Chip Green LED; Manufacturer: AVAGO TECHNOLOGIES; PressFit: No; Bonding: No; Part Number: LED_AVAGO_HSME-C120; Component Kind: Standard; Component Type: Standard; Color: Green; PackageDescription: Green Chip LED, 2-Leads, Body 1.7x1.1mm, Side Emitting Package; Manufacturer Part Number: HSME-C120; Pin Count: 2; Mounted: Yes; Socket: No; SMD: Yes; Sense: No; ComponentHeight: 0.7mm; HelpURL: \\cern.ch\dfs\Applications\Altium\Datasheets\LED_AVAGO_HSME-C120.pdf; ComponentLink1URL: \\cern.ch\dfs\Applications\Altium\Datasheets\LED_AVAGO_HSME-C110_DESIGN-GUIDE.pdf; ComponentLink1Description: Design Guide; Author: CERN DEM JMW; CreateDate: 22.07.2009; LatestRevisionDate: 20.06.2012
R124 = R0402_4K7_1%_0.0625W_100PPM: as R45-R47 on sheet FPGA_PWR_CONFIG; Part Number: R0402_4K7_1%_0.0625W_100PPM; Component Kind: Standard; Component Type: Standard; Pin Count: 2; Value: 4k7; Status: Not Recommended; Power: 0.0625W; Manufacturer Part Number: R0402_4K7_1%_0.0625W_100PPM; Case: 0402; Mounted: Yes; Sense: No; Socket: No; SMD: Yes; Manufacturer1 Example: YAGEO PHYCOMP; Manufacturer1 ComponentHeight: 0.4mm; HelpURL: \\cern.ch\dfs\Applications\Altium\Datasheets\R0402_Phycomp_RC0402.pdf; Author: CERN DEM JLC; CreateDate: 03.12.2007; LatestRevisionDate: 17.10.2012
R125-R130 = R0402_0R_JUMPER: as R6 on sheet Power; Part Number: R0402_0R_JUMPER; Component Type: Standard; Pin Count: 2; Status: Not Recommended; Manufacturer Part Number: R0402_0R_JUMPER; Case: 0402; Mounted: Yes; Sense: No; Socket: No; SMD: Yes; Manufacturer1 Example: YAGEO PHYCOMP; Manufacturer1 ComponentHeight: 0.4mm; HelpURL: \\cern.ch\dfs\Applications\Altium\Datasheets\R0402_Phycomp_RC0402.pdf; Author: CERN DEM JLC; CreateDate: 03.12.2007; LatestRevisionDate: 17.10.2012
  R125 R127 R129: Value: no_value
  R126 R128 R130: Component Kind: Standard; Value: 0
R131-R134 = R0402_240R_1%_0.0625W_100PPM: Resistor - 1%; Part Description: General Purpose Thick Film Chip Resistor; Manufacturer: GENERIC; Manufacturer1 Part Number: 232270672401L; TC: ±100ppm/°C; PressFit: No; Part Number: R0402_240R_1%_0.0625W_100PPM; Component Kind: Standard; Component Type: Standard; Pin Count: 2; Value: 240; Status: Not Recommended; Power: 0.0625W; Tolerance: ±1%; Manufacturer Part Number: R0402_240R_1%_0.0625W_100PPM; Case: 0402; Mounted: Yes; Sense: No; Socket: No; SMD: Yes; Manufacturer1 Example: YAGEO PHYCOMP; Manufacturer1 ComponentHeight: 0.4mm; HelpURL: \\cern.ch\dfs\Applications\Altium\Datasheets\R0402_Phycomp_RC0402.pdf; Author: CERN DEM JLC; CreateDate: 03.12.2007; LatestRevisionDate: 17.10.2012
T11-T14 = BSH103: as T1 on sheet Power; Part Number: BSH103; Component Kind: Standard; Component Type: Standard; Device: BSH103; PackageDescription: SOT23, 3 pin, Pitch 0.95mm - 1.3mm W X 2.9mm L X 1.1mm H, IPC Medium Density; Manufacturer Part Number: BSH103; Pin Count: 3; Case: SOT23-3; Mounted: Yes; Socket: No; SMD: Yes; Sense: No; ComponentHeight: 1.1mm; HelpURL: \\cern.ch\dfs\Applications\Altium\Datasheets\BSH103.pdf; Author: CERN DEM JLC; CreateDate: 16.03.2010; LatestRevisionDate: 20.06.2017

## Sheet TOD.SchDoc: SPEC-A7
size 420 x 297 mm; Author: G.Kasprowicz; CompanyName: WUT ISE; DrawnBy: G.Kasprowicz; Organization: WUT ISE; Address1: PW ISE; Address2: Nowowiejska 15/19 00-665 Warsaw; Address3: gkasprow@gmail.com; Revision: 2; SheetNumber: 17; SheetTotal: 18; ModifiedBy: -; CheckedDate: -; Title2: TOD IN & OUT; DivGrp: WUT ISE; Designer: G.Kasprowicz; ModifiedDate: -; ProjectName: Sensor Box
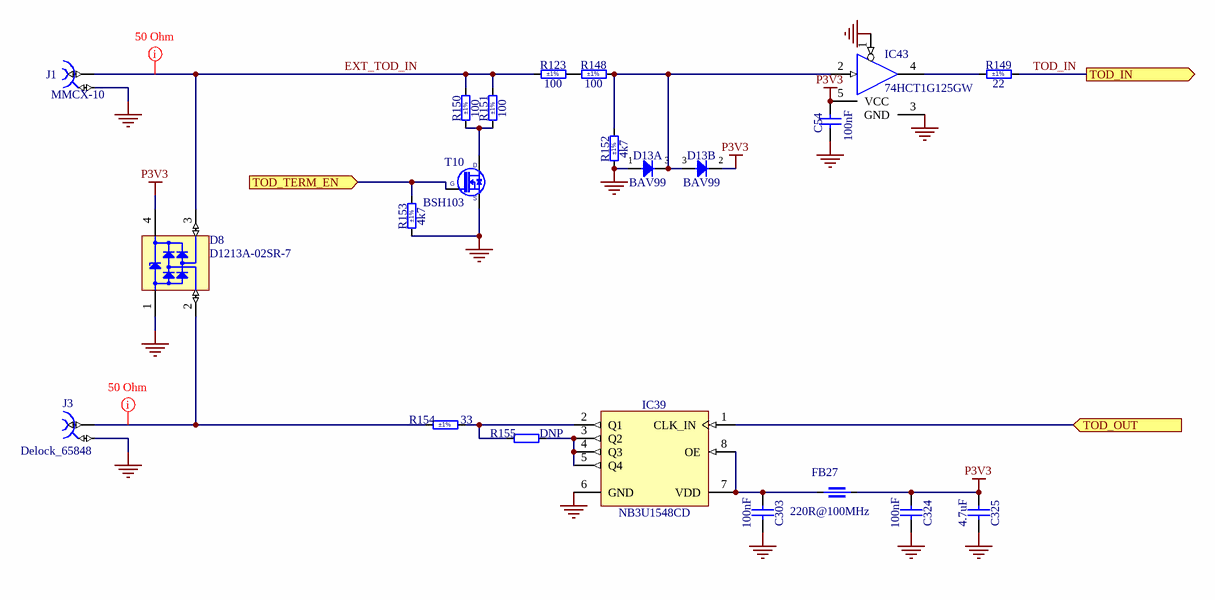
[diagram p16: TOD.SchDoc]

### Parts
C54  100nF  [CAPC0603X33N]
C303  100nF  [CAPC0603X33N]
C324  100nF  [CAPC0603X33N]
C325  4.7uF  [CAPC1005X55N]
D8  D1213A-02SR-7  [SOT190P238X100-4N]
D13  BAV99  [SOT95P240X110-3N]  (parts A,B of 2)
FB27  220R@100MHz  [INDC1608X95N]
IC39  NB3U1548CD  [SOIC127P600X175-8N]
IC43  74HCT1G125GW  [SOT65P210X110-5N]
J1  MMCX-10  [SAMTEC_MMCX-J-P-H-ST-TH1]
J3  Delock_65848  [Delock_65848]
R123  100  Tolerance: ±1%  [RESC1005X40N]
R148  100  Tolerance: ±1%  [RESC1005X40N]
R149  22  Tolerance: ±1%  [RESC1005X40N]
R150  100  Tolerance: ±1%  [RESC1005X40N]
R151  100  Tolerance: ±1%  [RESC1005X40N]
R152  4k7  Tolerance: ±1%  [RESC1005X40N]
R153  4k7  Tolerance: ±1%  [RESC1005X40N]
R154  33  Tolerance: ±1%  [RESC2012X60N]
R155  DNP  [RESC1005X40N]  (no BOM)
T10  BSH103  [SOT95P230X110-3N]

### Ports
TOD_IN (out, see SPEC-A7-TOP[3B], FPGA_34[2C]), TOD_OUT (in, see SPEC-A7-TOP[3B], FPGA_34[2D]), TOD_TERM_EN (in, see SPEC-A7-TOP[3B], FPGA_34[2C])

### Nets
GND: C54.1 C303.1 C324.1 C325.1 D8.1(GND) D13.1(A) IC39.6(GND) IC43.1(~{G}) IC43.3(GND) J1.2 J3.2 R152.1 R153.1 T10.2(S)
P3V3: C54.2 C324.2 C325.2 D8.4(VCC) D13.2(C) FB27.1 IC43.5(VCC)
EXT_TOD_IN: D8.3(I/O2) J1.1 R123.1 R150.2 R151.2
TOD_IN: R149.2 ; port TOD_IN
TOD_OUT: IC39.1(CLK_IN) ; port TOD_OUT
NetC303_2: C303.2 FB27.2 IC39.7(VDD) IC39.8(OE)
NetD8_2: D8.2(I/O1) J3.1 R154.1
NetD13_3: D13.3(COMAC) IC43.2(IN) R148.2 R152.2
NetIC4_T3: R153.2 T10.1(G) ; port TOD_TERM_EN
NetIC39_2: IC39.2(Q1) R154.2 R155.1
NetIC39_3: IC39.3(Q2) IC39.4(Q3) IC39.5(Q4) R155.2
NetIC43_4: IC43.4(OUT) R149.1
NetR123_2: R123.2 R148.1
NetR150_1: R150.1 R151.1 T10.3(D)

### Layout directives
net class 50_Ohm: EXT_TOD_IN, NetD8_2

### Notes on the sheet
- Project/Equipment
- Document
- Designer
- Drawn by
- Check.by
- Copyright WUT ISE 2024.
  This documentation describes Open Hardware and is licensed under the CERN OHL v.2. You may redistribute and modify this documentation under the terms of the CERN OHL v.2. (http://ohwr.org/CERNOHL). This documentation is distributed WITHOUT ANY EXPRESS OR IMPLIED WARRANTY, INCLUDING OF MERCHANTABILITY, SATISFACTORY QUALITY AND FITNESS FOR A PARTICULAR PURPOSE. Please see the CERN OHL v.2 for applicable conditions.
- Contact
- File
- Last Mod.
- Print Date
- Sheet
- Size
- A3
- of
- Rev

### Library data of the parts
C54 C303 C324 = CC0201_100NF_6.3V_10%_X5R: as C57-C66 on sheet FPGA_PWR_CONFIG; Part Number: CC0201_100NF_6.3V_10%_X5R; Component Kind: Standard; Component Type: Standard; Pin Count: 2; Value: 100nF; Status: Not Recommended; Manufacturer Part Number: CC0201_100NF_6.3V_10%_X5R; Case: 0201; Mounted: Yes; Socket: No; SMD: Yes; Sense: No; Manufacturer1 Example: AVX; Manufacturer1 ComponentHeight: 0.33mm; HelpURL: \\cern.ch\dfs\Applications\Altium\Datasheets\CC0201_X5R_AVX.pdf; Author: CERN DEM JLC; CreateDate: 03.12.2007; LatestRevisionDate: 03.12.2007
C325 = CC0402_4.7UF_6.3V_20%_X5R: Non-polarised capacitor; Part Description: SMD Multilayer Chip Ceramic Capacitor; Manufacturer: GENERIC; Manufacturer1 Part Number: C1005X5R0J475M050BC; Voltage: 6.3V; TC: X5R; Tolerance: ±20%; Part Number: CC0402_4.7UF_6.3V_20%_X5R; Component Kind: Standard; Component Type: Standard; Pin Count: 2; Value: 4.7uF; Status: Preferred; Manufacturer Part Number: CC0402_4.7UF_6.3V_20%_X5R; Case: 0402; Mounted: Yes; Socket: No; SMD: Yes; Sense: No; Manufacturer1 Example: TDK; Manufacturer1 ComponentHeight: 0.65mm; HelpURL: \\cern.ch\dfs\Applications\Altium\Datasheets\CC0402_X5R_TDK_C.pdf; Author: CERN DEM JLC; CreateDate: 03.03.2015; LatestRevisionDate: 03.03.2015
D8 = CMP-004-00039-1: D1213A-02SR Series 400 mW Uni-Directional Surface Mount TVS Diode - SOT-143; Mounting Technology: Surface Mount; Case/Package: SOT-143; Max Operating Temperature: 150°C; Pins: 4; Min Operating Temperature: -65°C
D13 = BAV99: Serial Diode; Part Description: Dual Series Signal Diode; Manufacturer: FAIRCHILD SEMICONDUCTOR; Voltage: 70V; Power: 350mW; PressFit: No; Bonding: No; Part Number: BAV99; Component Kind: Standard; Component Type: Standard; Device: BAV99; PackageDescription: SOT, 0.95mm Pitch; 3 Pin, 1.40mm W X 3.00mm L X 1.10mm H body, IPC Medium Density; Manufacturer Part Number: BAV99; Pin Count: 3; Case: SOT23-3; Mounted: Yes; Socket: No; SMD: Yes; Sense: No; ComponentHeight: 1.1mm; HelpURL: \\cern.ch\dfs\Applications\Altium\Datasheets\BAV99.pdf; Author: CERN DEM JLC; CreateDate: 06.05.2008; LatestRevisionDate: 27.09.2012
FB27 = IND0603_MURATA_BLM18SG221TN1: Part Description: SMD EMIFIL Suppression Chip Ferrite Bead; Manufacturer: MURATA; Tolerance: ±25%; Power: 2.5A; Resistance: 0.04R; Part Number: IND0603_MURATA_BLM18SG221TN1; Component Kind: Standard; Component Type: Standard; Pin Count: 2; Value: 220R@100MHz; Manufacturer Part Number: BLM18SG221TN1; Case: 0603; Mounted: Yes; Socket: No; SMD: Yes; Sense: No; ComponentHeight: 0.95mm; HelpURL: \\cern.ch\dfs\Applications\Altium\Datasheets\IND0603_MURATA_BLM18S.pdf; Author: CERN DEM MR; CreateDate: 08.01.2016; LatestRevisionDate: 25.10.2018
IC39 = NB3U1548CD: 3.3V/2.5V/1.8V/1.5V 160 MHz 1:4 LVCMOS/LVTTL Low Skew Over Voltage Tolerant Fanout Buffer; Manufacturer: ON SEMICONDUCTOR; PressFit: No; Bonding: No; Part Number: NB3U1548CD; Component Kind: Standard; Component Type: Standard; Device: NB3U1548CD; PackageDescription: SOIC 8, Pitch 1.27mm, Body 4x5mm, IPC Medium Density; Part Description: 3.3V/2.5V/1.8V/1.5V 160 MHz 1:4 LVCMOS/LVTTL Low Skew Over Voltage Tolerant Fanout Buffer; Manufacturer Part Number: NB3U1548CD; Pin Count: 8; Case: SOIC8; Mounted: Yes; Socket: No; SMD: Yes; Sense: No; ComponentHeight: 1.75mm; Author: CERN DEM HF; HelpURL: \\cern.ch\dfs\Applications\Altium\Datasheets\NB3U1548C.pdf; CreateDate: 29.11.2024; LatestRevisionDate: 29.11.2024
IC43 = 74HCT1G125GW: Single Bus Buffer Gate With 3-State Output; Part Description: Bus Buffer/Line Driver 3-State; Manufacturer: NEXPERIA; PressFit: No; Bonding: No; Part Number: 74HCT1G125GW; Component Kind: Standard; Component Type: Standard; Device: 74HCT1G125GW; PackageDescription: SOT353, SC70-5, 0.65mm Pitch; 5 Pin, 1.25mm W X 2.00mm L X 1.10mm H body, IPC Medium Density; Manufacturer Part Number: 74HCT1G125GW; Pin Count: 5; Case: SOT353; Mounted: Yes; Socket: No; SMD: Yes; Sense: No; ComponentHeight: 1.1mm; Author: CERN DEM JMW; HelpURL: \\cern.ch\dfs\Applications\Altium\Datasheets\74HCT1G125GW.pdf; CreateDate: 06.08.2020; LatestRevisionDate: 06.08.2020
J1 = CON_MMCX_V: Part Description: Straight Through-hole 50 Ohms Micro Mini RF Jack, MMCX Series; Manufacturer: Ninigi; PressFit: No; Part Number: MMCX-10; Component Kind: Standard; Component Type: Standard; Pin Count: 2; Mounted: Yes; Socket: No; SMD: No; Sense: No; Status: None; Manufacturer Part Number: MMCX-10; ComponentHeight: 4.35mm; Author: GK; CreateDate: 05.12.2012; LatestRevisionDate: 05.12.2012
J3 = CMP-002-04652-1: SMA connector Delock 65848
R123 R148 R150 R151 = R0402_100R_1%_0.0625W_100PPM: Resistor - 1%; Part Description: General Purpose Thick Film Chip Resistor; Manufacturer: GENERIC; Manufacturer1 Part Number: 232270671001L; TC: ±100ppm/°C; PressFit: No; Part Number: R0402_100R_1%_0.0625W_100PPM; Component Kind: Standard; Component Type: Standard; Pin Count: 2; Value: 100; Status: Not Recommended; Power: 0.0625W; Manufacturer Part Number: R0402_100R_1%_0.0625W_100PPM; Case: 0402; Mounted: Yes; Sense: No; Socket: No; SMD: Yes; Manufacturer1 Example: YAGEO PHYCOMP; Manufacturer1 ComponentHeight: 0.4mm; HelpURL: \\cern.ch\dfs\Applications\Altium\Datasheets\R0402_Phycomp_RC0402.pdf; Author: CERN DEM JLC; CreateDate: 03.12.2007; LatestRevisionDate: 17.10.2012
R149 = R0402_22R_1%_0.0625W_100PPM: Resistor - 1%; Part Description: General Purpose Thick Film Chip Resistor; Manufacturer: GENERIC; Manufacturer1 Part Number: 232270672209L; TC: ±100ppm/°C; PressFit: No; Part Number: R0402_22R_1%_0.0625W_100PPM; Component Kind: Standard; Component Type: Standard; Pin Count: 2; Value: 22; Status: Not Recommended; Power: 0.0625W; Manufacturer Part Number: R0402_22R_1%_0.0625W_100PPM; Case: 0402; Mounted: Yes; Sense: No; Socket: No; SMD: Yes; Manufacturer1 Example: YAGEO PHYCOMP; Manufacturer1 ComponentHeight: 0.4mm; HelpURL: \\cern.ch\dfs\Applications\Altium\Datasheets\R0402_Phycomp_RC0402.pdf; Author: CERN DEM JLC; CreateDate: 03.12.2007; LatestRevisionDate: 17.10.2012
R152 R153 = R0402_4K7_1%_0.0625W_100PPM: as R45-R47 on sheet FPGA_PWR_CONFIG; Part Number: R0402_4K7_1%_0.0625W_100PPM; Component Kind: Standard; Component Type: Standard; Pin Count: 2; Value: 4k7; Status: Not Recommended; Power: 0.0625W; Manufacturer Part Number: R0402_4K7_1%_0.0625W_100PPM; Case: 0402; Mounted: Yes; Sense: No; Socket: No; SMD: Yes; Manufacturer1 Example: YAGEO PHYCOMP; Manufacturer1 ComponentHeight: 0.4mm; HelpURL: \\cern.ch\dfs\Applications\Altium\Datasheets\R0402_Phycomp_RC0402.pdf; Author: CERN DEM JLC; CreateDate: 03.12.2007; LatestRevisionDate: 17.10.2012
R154 = R0805_33R_1%_0.125W_100PPM: Resistor - 1%; Part Description: General Purpose Thick Film Chip Resistor; Manufacturer: GENERIC; Manufacturer1 Part Number: NRC10F33R0TRF; PressFit: No; Power: 0.125W; TC: ±100ppm/°C; Part Number: R0805_33R_1%_0.125W_100PPM; Component Kind: Standard; Component Type: Standard; Pin Count: 2; Value: 33; Status: Preferred; Manufacturer Part Number: R0805_33R_1%_0.125W_100PPM; Case: 0805; Mounted: Yes; Sense: No; Socket: No; SMD: Yes; Manufacturer1 Example: NIC COMPONENT; Manufacturer1 ComponentHeight: 0.6mm; HelpURL: \\cern.ch\dfs\Applications\Altium\Datasheets\R0805_NIC_NRC.pdf; Author: CERN DEM JLC; CreateDate: 03.12.2007; LatestRevisionDate: 13.03.2008
R155 = R0402_0R_JUMPER: as R6 on sheet Power; Part Number: R0402_0R_JUMPER; Component Type: Standard; Pin Count: 2; Value: DNP; Status: Not Recommended; Manufacturer Part Number: R0402_0R_JUMPER; Case: 0402; Mounted: Yes; Sense: No; Socket: No; SMD: Yes; Manufacturer1 Example: YAGEO PHYCOMP; Manufacturer1 ComponentHeight: 0.4mm; HelpURL: \\cern.ch\dfs\Applications\Altium\Datasheets\R0402_Phycomp_RC0402.pdf; Author: CERN DEM JLC; CreateDate: 03.12.2007; LatestRevisionDate: 17.10.2012
T10 = BSH103: as T1 on sheet Power; Part Number: BSH103; Component Kind: Standard; Component Type: Standard; Device: BSH103; PackageDescription: SOT23, 3 pin, Pitch 0.95mm - 1.3mm W X 2.9mm L X 1.1mm H, IPC Medium Density; Manufacturer Part Number: BSH103; Pin Count: 3; Case: SOT23-3; Mounted: Yes; Socket: No; SMD: Yes; Sense: No; ComponentHeight: 1.1mm; HelpURL: \\cern.ch\dfs\Applications\Altium\Datasheets\BSH103.pdf; Author: CERN DEM JLC; CreateDate: 16.03.2010; LatestRevisionDate: 20.06.2017